# EAGLE design PQS42019.2 v4 (EAGLE 9.3.2)
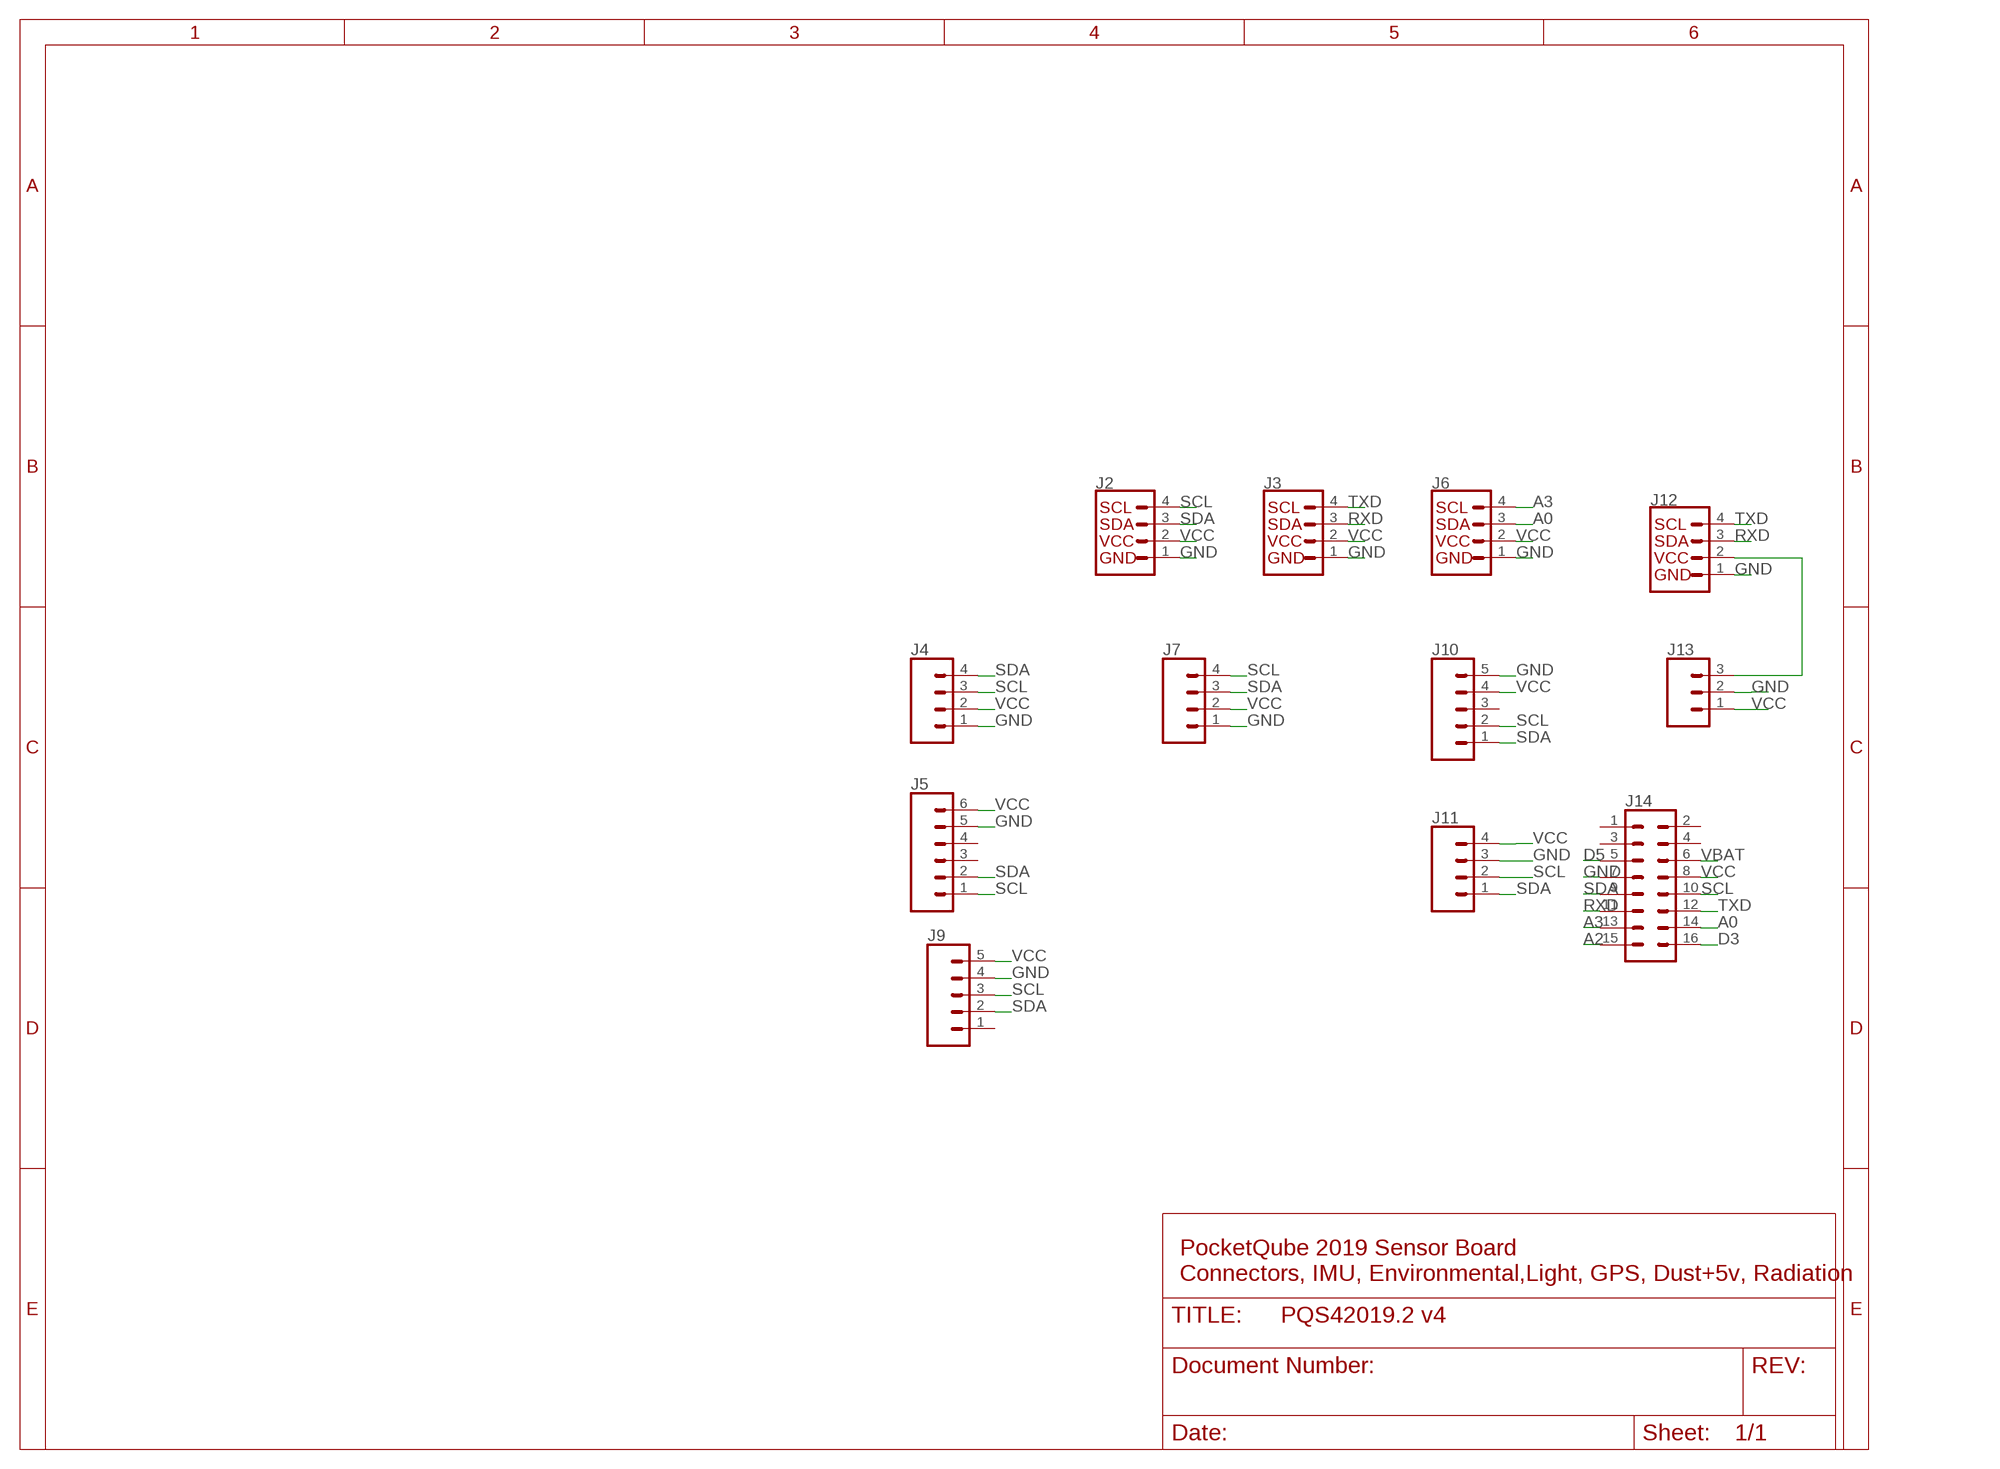
[diagram p0: schematic, sheet 1]

## Parts
J2  QWIIC_CONNECTORJS-1MM  [1X04_1MM_RA]
J3  QWIIC_CONNECTORJS-1MM  [1X04_1MM_RA]
J4  CONN_04  [1X04]
J5  CONN_06SILK_FEMALE_PTH  [1X06]
J6  QWIIC_CONNECTORJS-1MM  [1X04_1MM_RA]
J7  CONN_04  [1X04]
J9  CONN_05  [1X05]
J10  CONN_05  [1X05]
J11  CONN_04  [1X04]
J12  QWIIC_CONNECTORJS-1MM  [1X04_1MM_RA]
J13  CONN_03  [1X03]
J14  CONN_08X2  [2X8]

## Nets
A0: J6.3 J14.14
A2: J14.15
A3: J6.4 J14.13
D3: J14.16
D5: J14.5
GND [power]: J2.1 J3.1 J4.1 J5.5 J6.1 J7.1 J9.4 J10.5 J11.3 J12.1 J13.2 J14.7
N$1: J12.2 J13.3
RXD: J3.3 J12.3 J14.11
SCL: J2.4 J4.3 J5.1 J7.4 J9.3 J10.2 J11.2 J14.10
SDA: J2.3 J4.4 J5.2 J7.3 J9.2 J10.1 J11.1 J14.9
TXD: J3.4 J12.4 J14.12
VBAT: J14.6
VCC: J2.2 J3.2 J4.2 J5.6 J6.2 J7.2 J9.5 J10.4 J11.4 J13.1 J14.8
Unconnected: J5.3 J5.4 J9.1 J10.3 J14.1 J14.2 J14.3 J14.4

## Notes on the sheet
- PocketQube 2019 Sensor Board
  Connectors, IMU, Environmental,Light, GPS, Dust+5v, Radiation

## Library data of the parts
J2 J3 J6 J12 = SparkFun-Connectors:QWIIC_CONNECTOR: SparkFun I2C Standard Qwiic Connector An SMD 1mm pitch JST connector makes it easy and quick (get it? Qwiic?) to connect I2C devices to each other. The Qwiic system <http://www.sparkfun.com/qwiic> enables fast and solderless connection between popular platforms and various sensors and actuators. We carry 200mm <https://www.sparkfun.com/products/14204>, 100mm <https://www.sparkfun.com/products/14205>, 50mm <https://www.sparkfun.com/products/14206>, and breadboard friendly <https://www.sparkfun.com/products/14207> Qwiic cables. We also offer 10 pcs strips <https://www.sparkfun.com/products/14323> the SMD connectors.; PROD_ID: CONN-13694
J4 J7 J11 = SparkFun-Connectors:CONN_04: Multi connection point. Often used as Generic Header-pin footprint for 0.1 inch spaced/style header connections On any of the 0.1 inch spaced packages, you can populate with these: Break Away Headers - Straight <https://www.sparkfun.com/products/116> (PRT-00116) Break Away Male Headers - Right Angle <https://www.sparkfun.com/products/553> (PRT-00553) Female Headers <https://www.sparkfun.com/products/115> (PRT-00115) Break Away Headers - Machine Pin <https://www.sparkfun.com/products/117> (PRT-00117) Break Away Female Headers - Swiss Machine Pin <https://www.sparkfun.com/products/743> (PRT-00743) For SCREWTERMINALS and SPRING TERMINALS visit here: Screw Terimnals on SparkFun.com <https://www.sparkfun.com/search/results?term=Screw+Terminals> (5mm/3.5mm/2.54mm spacing) This device is also useful as a general connection point to wire up your design to another part of your project. Our various solder wires solder well into these plated through hole pads. Hook-Up Wire - Assortment (Stranded, 22 AWG) <https://www.sparkfun.com/products/11375> (PRT-11375) Hook-Up Wire - Assortment (Solid Core, 22 AWG) <https://www.sparkfun.com/products/11367> (PRT-11367) View the entire wire category on our website here <https://www.sparkfun.com/categories/141> Special notes: Molex polarized connector foot print use with SKU : PRT-08231 with associated crimp pins and housings. 1MM SMD Version SKU: PRT-10208; PROD_ID: CONN-09696
J5 = SparkFun-Connectors:CONN_06: Multi connection point. Often used as Generic Header-pin footprint for 0.1 inch spaced/style header connections On any of the 0.1 inch spaced packages, you can populate with these: Break Away Headers - Straight <https://www.sparkfun.com/products/116> (PRT-00116) Break Away Male Headers - Right Angle <https://www.sparkfun.com/products/553> (PRT-00553) Female Headers <https://www.sparkfun.com/products/115> (PRT-00115) Break Away Headers - Machine Pin <https://www.sparkfun.com/products/117> (PRT-00117) Break Away Female Headers - Swiss Machine Pin <https://www.sparkfun.com/products/743> (PRT-00743) Arduino Stackable Header - 6 Pin <https://www.sparkfun.com/products/9280> (PRT-09280) For SCREWTERMINALS and SPRING TERMINALS visit here: Screw Terimnals on SparkFun.com <https://www.sparkfun.com/search/results?term=Screw+Terminals> (5mm/3.5mm/2.54mm spacing) This device is also useful as a general connection point to wire up your design to another part of your project. Our various solder wires solder well into these plated through hole pads. Hook-Up Wire - Assortment (Stranded, 22 AWG) <https://www.sparkfun.com/products/11375> (PRT-11375) Hook-Up Wire - Assortment (Solid Core, 22 AWG) <https://www.sparkfun.com/products/11367> (PRT-11367) View the entire wire category on our website here <https://www.sparkfun.com/categories/141>; PROD_ID: CONN-08437
J9 J10 = SparkFun-Connectors:CONN_05: Multi connection point. Often used as Generic Header-pin footprint for 0.1 inch spaced/style header connections On any of the 0.1 inch spaced packages, you can populate with these: Break Away Headers - Straight <https://www.sparkfun.com/products/116> (PRT-00116) Break Away Male Headers - Right Angle <https://www.sparkfun.com/products/553> (PRT-00553) Female Headers <https://www.sparkfun.com/products/115> (PRT-00115) Break Away Headers - Machine Pin <https://www.sparkfun.com/products/117> (PRT-00117) Break Away Female Headers - Swiss Machine Pin <https://www.sparkfun.com/products/743> (PRT-00743) For SCREWTERMINALS and SPRING TERMINALS visit here: Screw Terimnals on SparkFun.com <https://www.sparkfun.com/search/results?term=Screw+Terminals> (5mm/3.5mm/2.54mm spacing) This device is also useful as a general connection point to wire up your design to another part of your project. Our various solder wires solder well into these plated through hole pads. Hook-Up Wire - Assortment (Stranded, 22 AWG) <https://www.sparkfun.com/products/11375> (PRT-11375) Hook-Up Wire - Assortment (Solid Core, 22 AWG) <https://www.sparkfun.com/products/11367> (PRT-11367) View the entire wire category on our website here <https://www.sparkfun.com/categories/141> Special notes: Molex polarized connector foot print use with SKU : PRT-08231 with associated crimp pins and housings. 1MM SMD Version SKU: PRT-10208
J13 = SparkFun-Connectors:CONN_03: Multi connection point. Often used as Generic Header-pin footprint for 0.1 inch spaced/style header connections On any of the 0.1 inch spaced packages, you can populate with these: Break Away Headers - Straight <https://www.sparkfun.com/products/116> (PRT-00116) Break Away Male Headers - Right Angle <https://www.sparkfun.com/products/553> (PRT-00553) Female Headers <https://www.sparkfun.com/products/115> (PRT-00115) Break Away Headers - Machine Pin <https://www.sparkfun.com/products/117> (PRT-00117) Break Away Female Headers - Swiss Machine Pin <https://www.sparkfun.com/products/743> (PRT-00743) Stackable Header - 3 Pin (Female, 0.1") <https://www.sparkfun.com/products/13875> (PRT-13875) For SCREWTERMINALS and SPRING TERMINALS visit here: Screw Terimnals on SparkFun.com <https://www.sparkfun.com/search/results?term=Screw+Terminals> (5mm/3.5mm/2.54mm spacing) This device is also useful as a general connection point to wire up your design to another part of your project. Our various solder wires solder well into these plated through hole pads. Hook-Up Wire - Assortment (Stranded, 22 AWG) <https://www.sparkfun.com/products/11375> (PRT-11375) Hook-Up Wire - Assortment (Solid Core, 22 AWG) <https://www.sparkfun.com/products/11367> (PRT-11367) View the entire wire category on our website here <https://www.sparkfun.com/categories/141> Special notes: Molex polarized connector foot print use with SKU : PRT-08232 with associated crimp pins and housings.
J14 = SparkFun-Connectors:CONN_08X2: Multi connection point. Often used as Generic Header-pin footprint for 0.1 inch spaced/style header connections You can populate with any combo of single row headers, but if you'd like an exact match, check this: Header - 2x8 (Male, 0.1") <https://www.sparkfun.com/products/13156> (PRT-13156) On any of the 0.1 inch spaced packages, you can populate with these: Break Away Headers - Straight <https://www.sparkfun.com/products/116> (PRT-00116) Break Away Male Headers - Right Angle <https://www.sparkfun.com/products/553> (PRT-00553) Female Headers <https://www.sparkfun.com/products/115> (PRT-00115) Break Away Headers - Machine Pin <https://www.sparkfun.com/products/117> (PRT-00117) Break Away Female Headers - Swiss Machine Pin <https://www.sparkfun.com/products/743> (PRT-00743)

## Net classes
1 power: width 0.305 mm

## Board
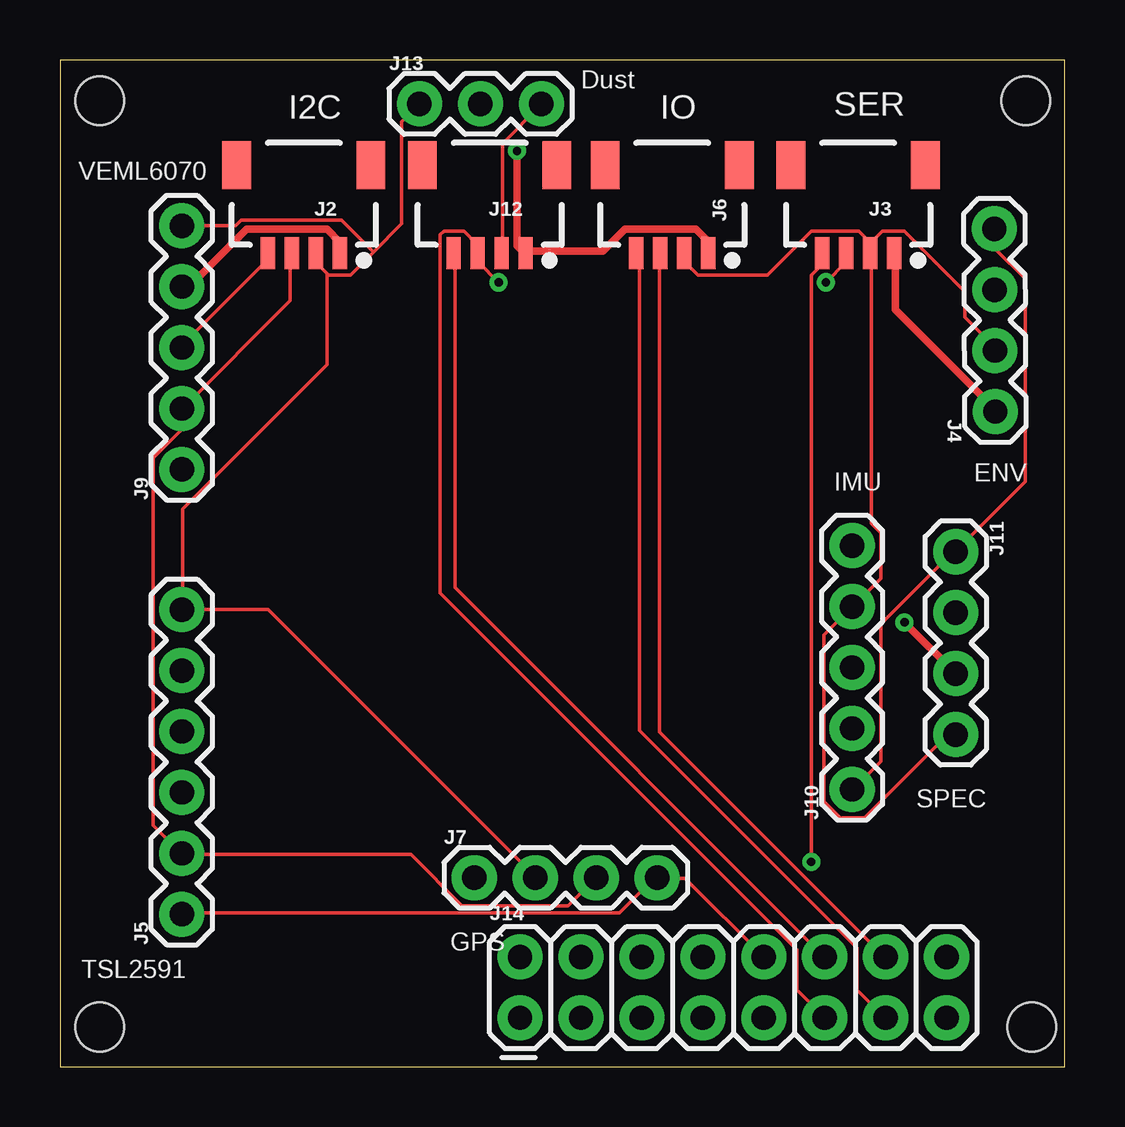
[diagram p1: board, top side]
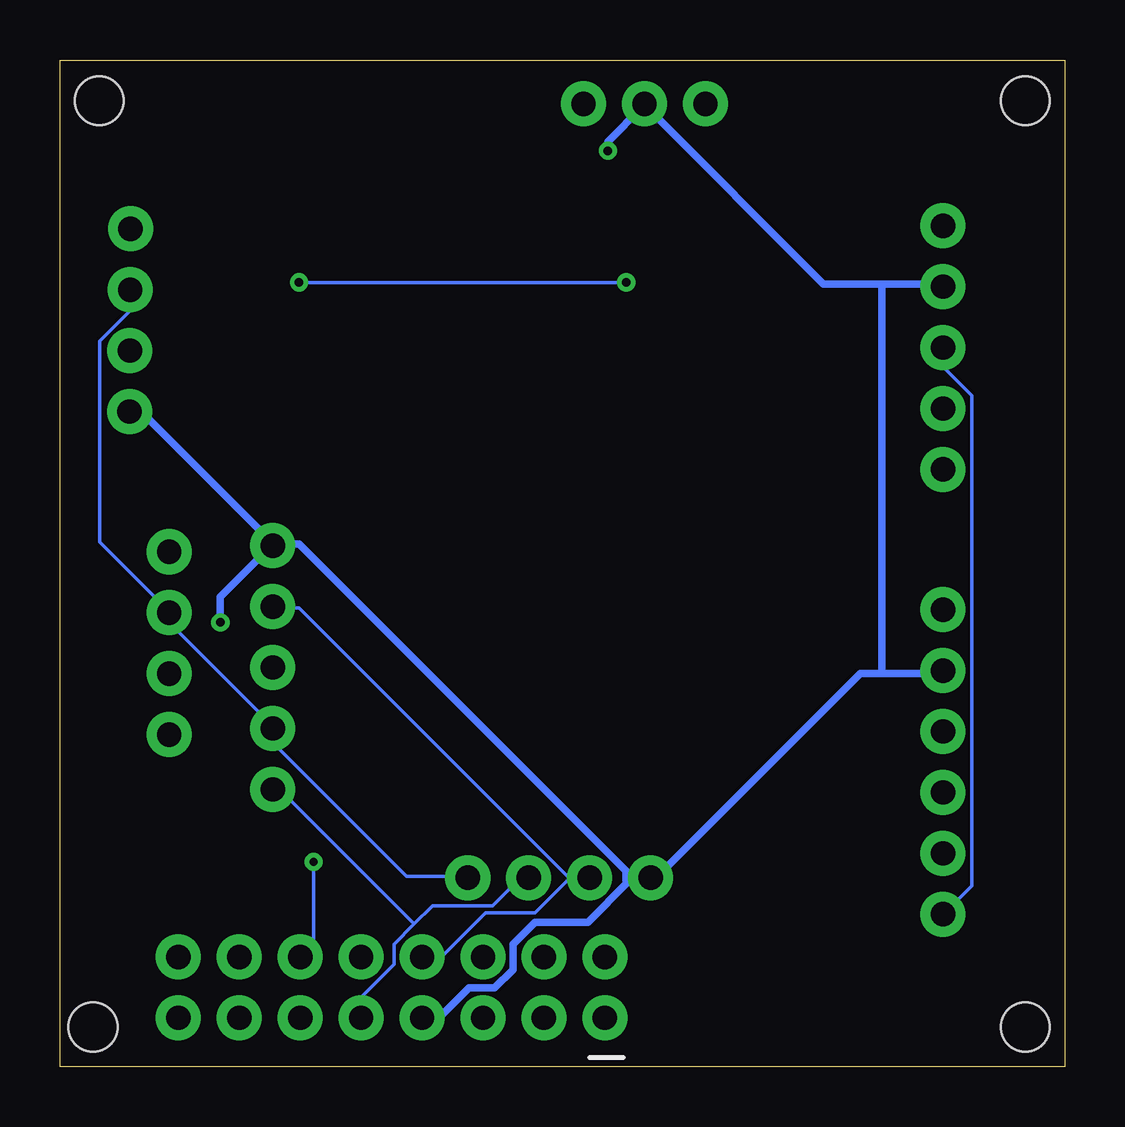
[diagram p2: board, bottom side, seen from below]

Size 41.89 x 41.96 mm. Coordinates in mm from the lower left corner, seen from the top.
Outline: 0,0 41.89,0 41.89,41.96 0,41.96 0,0
Copper layers (1*16): Top 0.035mm / dielectric 1.5mm / Bottom 0.035mm
Design rules "default": minimum track width 6mil, minimum drill 0.35mm, track to track 6mil, track to pad 6mil, pad to pad 6mil, via to via 6mil, smd to smd 6mil, copper to edge 40mil, drill to drill 6mil, minimum pad ring 10mil, minimum via ring 8mil, stop-mask expansion 4mil, vias tented up to drill 0mil, thermal gap 10mil
Holes 2.03 mm at 1.65,1.65 40.26,40.26 40.51,1.65 1.65,40.26

### Footprints (pad centres in the part's own frame; a part is rotated, then mirrored left to right if it is on the bottom)
1X04_1MM_RA = smd 0.6 x 1.35: 1 -1.5,0; 2 -0.5,0; 3 0.5,0; 4 1.5,0 | smd 1.2 x 2: NC1 2.8,-3.675; NC2 -2.8,-3.675
1X04 = drill 1.016 pad 1.88: 1 0,0; 2 2.54,0; 3 5.08,0; 4 7.62,0
1X06 = drill 1.016 pad 1.88: 1 0,0; 2 2.54,0; 3 5.08,0; 4 7.62,0; 5 10.16,0; 6 12.7,0
1X05 = drill 1.016 pad 1.88: 1 0,0; 2 2.54,0; 3 5.08,0; 4 7.62,0; 5 10.16,0
1X03 = drill 1.016 pad 1.88: 1 0,0; 2 2.54,0; 3 5.08,0
2X8 = drill 1.016 pad 1.88: 1 0,0; 2 0,2.54; 3 2.54,0; 4 2.54,2.54; 5 5.08,0; 6 5.08,2.54; 7 7.62,0; 8 7.62,2.54; 9 10.16,0; 10 10.16,2.54; 11 12.7,0; 12 12.7,2.54; 13 15.24,0; 14 15.24,2.54; 15 17.78,0; 16 17.78,2.54

### Placement (x,y rotation side)
J2  10.16,33.91 180 top
J3  33.27,33.91 180 top
J4  38.99,27.3 90.3 top
J5  5.08,6.35 90 top
J6  25.53,33.91 180 top
J7  17.27,7.87 0 top
J9  5.08,24.89 90 top
J10  33.02,11.56 90 top
J11  37.34,21.46 270 top
J12  17.91,33.91 180 top
J13  14.99,40.13 0 top
J14  19.18,2.03 0 top

### Tracks (layer width: path | path; a pad name or v marks a point on that pad's centre or on a via)
A0
  Top 0.152: 24.99,33.86 J6.3 | 24.99,33.81 J6.3 | 24.99,33.76 J6.3 | J6.3 24.99,33.68 24.99,13.95 34.37,4.57 J14.14
A3
  Top 0.152: 24.08,33.86 J6.4 | 24.16,33.83 J6.4 | J6.4 24.16,33.76 24.16,14.02 33.22,4.95 33.22,3.2 34.37,2.06 J14.13
GND  (via drill 0.35)
  Top 0.305: 38.94,27.28 J4.1 38.94,27.43 34.82,31.55 34.82,33.91 J3.1 | 27.05,33.81 J6.1 | 27.05,34.37 27.05,34.06 J6.1 | 27.13,33.68 J6.1 | J2.1 11.66,34.37 11.12,34.9 7.77,34.9 5.41,32.54 5.11,32.54 J9.4 | J6.1 26.98,34.44 26.52,34.9 23.55,34.9 22.63,33.98 19.51,33.98 J12.1 19.28,33.98 19.05,34.21 v19.05,38.18 | v35.2,18.52 J11.3
  Bottom 0.305: 26.75,2.06 J14.7 | 17.4,7.72 J7.1 | 32.99,21.79 J10.5 | 38.86,27.36 J4.1 | 5.03,16.54 J5.5 | 32.99,21.95 J10.5 | 38.56,27.36 38.71,27.36 J4.1 | 33.15,21.95 J10.5 | 18.21,7.7 17.53,7.7 J7.1 | 26.59,2.06 J14.7 | 5.03,32.46 J9.4 5.18,32.61 7.62,32.61 | 5.03,16.69 J5.5 | 17.14,7.92 J7.1 | 17.53,40.08 J13.2 | v19.05,38.18 19.05,38.56 17.6,40.01 J13.2 | 7.62,32.61 10.06,32.61 17.45,40.01 J13.2 | v35.2,18.52 35.2,19.58 33.15,21.64 J10.5 | J4.1 38.48,27.28 33.22,22.02 J10.5 | 18.21,7.7 19.89,6.02 22.1,6.02 23.01,5.11 23.01,4.04 23.77,3.28 24.84,3.28 26.06,2.06 26.44,2.06 J14.7 | 7.62,16.38 8.53,16.38 16.99,7.92 J7.1 | 7.62,16.38 5.18,16.38 J5.5 | J10.5 32.84,21.79 31.93,21.79 18.29,8.15 18.29,7.77 18.21,7.7 | 7.62,16.38 7.62,32.61
N$1
  Top 0.152: J12.2 18.44,33.91 18.44,38.48 20.04,40.08 J13.3
RXD  (via drill 0.35)
  Top 0.152: J14.11 30.71,3.2 30.71,4.88 15.85,19.74 15.85,34.67 16,34.82 16.84,34.82 17.37,34.29 17.37,33.91 J12.3 17.45,33.91 17.45,33.53 v18.29,32.69 | v31.93,32.69 32.77,33.53 J3.3
  Bottom 0.152: v18.29,32.69 v31.93,32.69
SCL
  Top 0.152: 24.84,7.85 J7.4 | 8.61,33.6 8.61,33.91 J2.4 8.61,33.6 | 8.61,33.6 5.11,30.1 J9.3 | J14.10 26.06,7.85 24.92,7.85 J7.4 | J5.1 5.11,6.4 23.32,6.4 24.77,7.85 J7.4
  Bottom 0.152: 24.87,7.87 J7.4 | 24.94,7.87 J7.4 | 33.07,14.1 J10.2 | 29.57,4.57 J14.10 | 24.84,7.87 J7.4 | 32.92,13.26 J10.2 | 24.99,7.92 J7.4 | 32.84,13.26 J10.2 | 39.01,31.47 39.01,32.31 J4.3 39.01,31.47 | J5.1 3.89,7.54 3.89,27.96 5.03,29.11 5.03,29.95 J9.3 | J7.4 25.07,7.92 27.43,7.92 32.77,13.26 J10.2 | J10.2 32.99,14.17 37.34,18.52 J11.2 37.34,18.97 40.23,21.87 40.23,30.25 39.01,31.47
SDA
  Top 0.152: J2.3 9.6,33.91 9.6,31.93 5.11,27.43 J9.2 5.03,27.43 5.03,26.52 3.89,25.38 3.89,10.06 5.03,8.91 J5.2 5.11,8.84 14.63,8.84 16.76,6.71 21.18,6.71 J7.3 | J10.1 33.07,11.58 34.21,12.72 34.21,18.44 37.19,21.41 37.34,21.41 J11.1 37.34,21.49 40.23,24.38 40.23,32.84 39.01,34.06 39.01,34.9 J4.4
  Bottom 0.152: 38.91,34.9 J4.4 | 22.4,7.87 J7.3 | 32.92,11.51 J10.1 | 32.84,11.51 J10.1 | 22.71,7.85 22.4,7.85 J7.3 | 32.77,11.51 J10.1 | J14.9 29.34,2.9 27.96,4.27 27.96,5.11 27.13,5.94 | 27.13,5.94 26.36,6.71 23.85,6.71 22.71,7.85 | 22.71,7.85 J7.3 | 27.13,5.94 32.69,11.51 J10.1
TXD  (via drill 0.35)
  Top 0.152: J12.4 16.46,33.91 16.46,19.96 31.85,4.57 J14.12 | v31.32,8.53 31.32,32.99 31.7,33.38 31.7,33.91 J3.4
  Bottom 0.152: v31.32,8.53 31.32,5.11 31.85,4.57 J14.12
VCC
  Top 0.152: 38.94,29.87 J4.2 | 33.83,34.29 33.83,33.91 | 38.94,29.95 J4.2 | 11.16,33.03 11.2,32.99 12.12,32.99 13.07,33.95 | 11.16,33.03 10.67,33.53 J2.2 | 13.07,33.95 14.25,35.13 14.25,39.4 J13.1 | 5.11,19.05 5.11,23.24 11.12,29.26 11.12,32.99 11.16,33.03 | J9.5 7.32,35.05 7.54,35.28 11.73,35.28 13.07,33.95 | 33.83,34.29 33.3,34.82 31.32,34.82 29.49,32.99 26.59,32.99 26.06,33.53 26.06,33.91 J6.2 | 33.83,34.29 J3.2 | J3.2 33.83,34.37 34.29,34.82 35.2,34.82 37.72,32.31 37.72,31.24 38.94,30.02 J4.2 | J11.4 37.34,13.79 36.96,13.79 33.53,10.36 32.54,10.36 31.85,11.05 31.85,17.98 32.99,19.13 J10.4 33.07,19.2 34.21,20.34 34.21,22.25 33.83,22.63 33.83,33.91 | 33.83,33.91 J3.2 | 5.11,19.05 8.69,19.05 19.81,7.92 J7.2 | 5.11,19.05 J5.6
  Bottom 0.152: 39.01,29.79 J4.2 | 32.99,19.13 J10.4 | 38.94,29.87 J4.2 | 32.92,19.13 J10.4 | 39.01,29.72 J4.2 | 38.86,29.87 J4.2 | 20.73,7.92 20.57,7.92 | 20.57,7.92 19.81,7.92 J7.2 | J10.4 32.84,19.13 31.93,19.13 20.73,7.92 | J14.8 25.98,4.57 24.16,6.4 22.1,6.4 20.57,7.92 | 20.57,7.92 J7.2 | 20.73,7.92 J7.2

### Text on the board
_tsilk: Dust | SER | I2C | IO | VEML6070 | IMU | ENV | SPEC | GPS | TSL2591